# EAGLE design FluxR3-v1 (EAGLE 7.2.0)
ABBREV: Flux3; AUTHOR: Nadya B.; PROJECT: Fluxamasynth R3
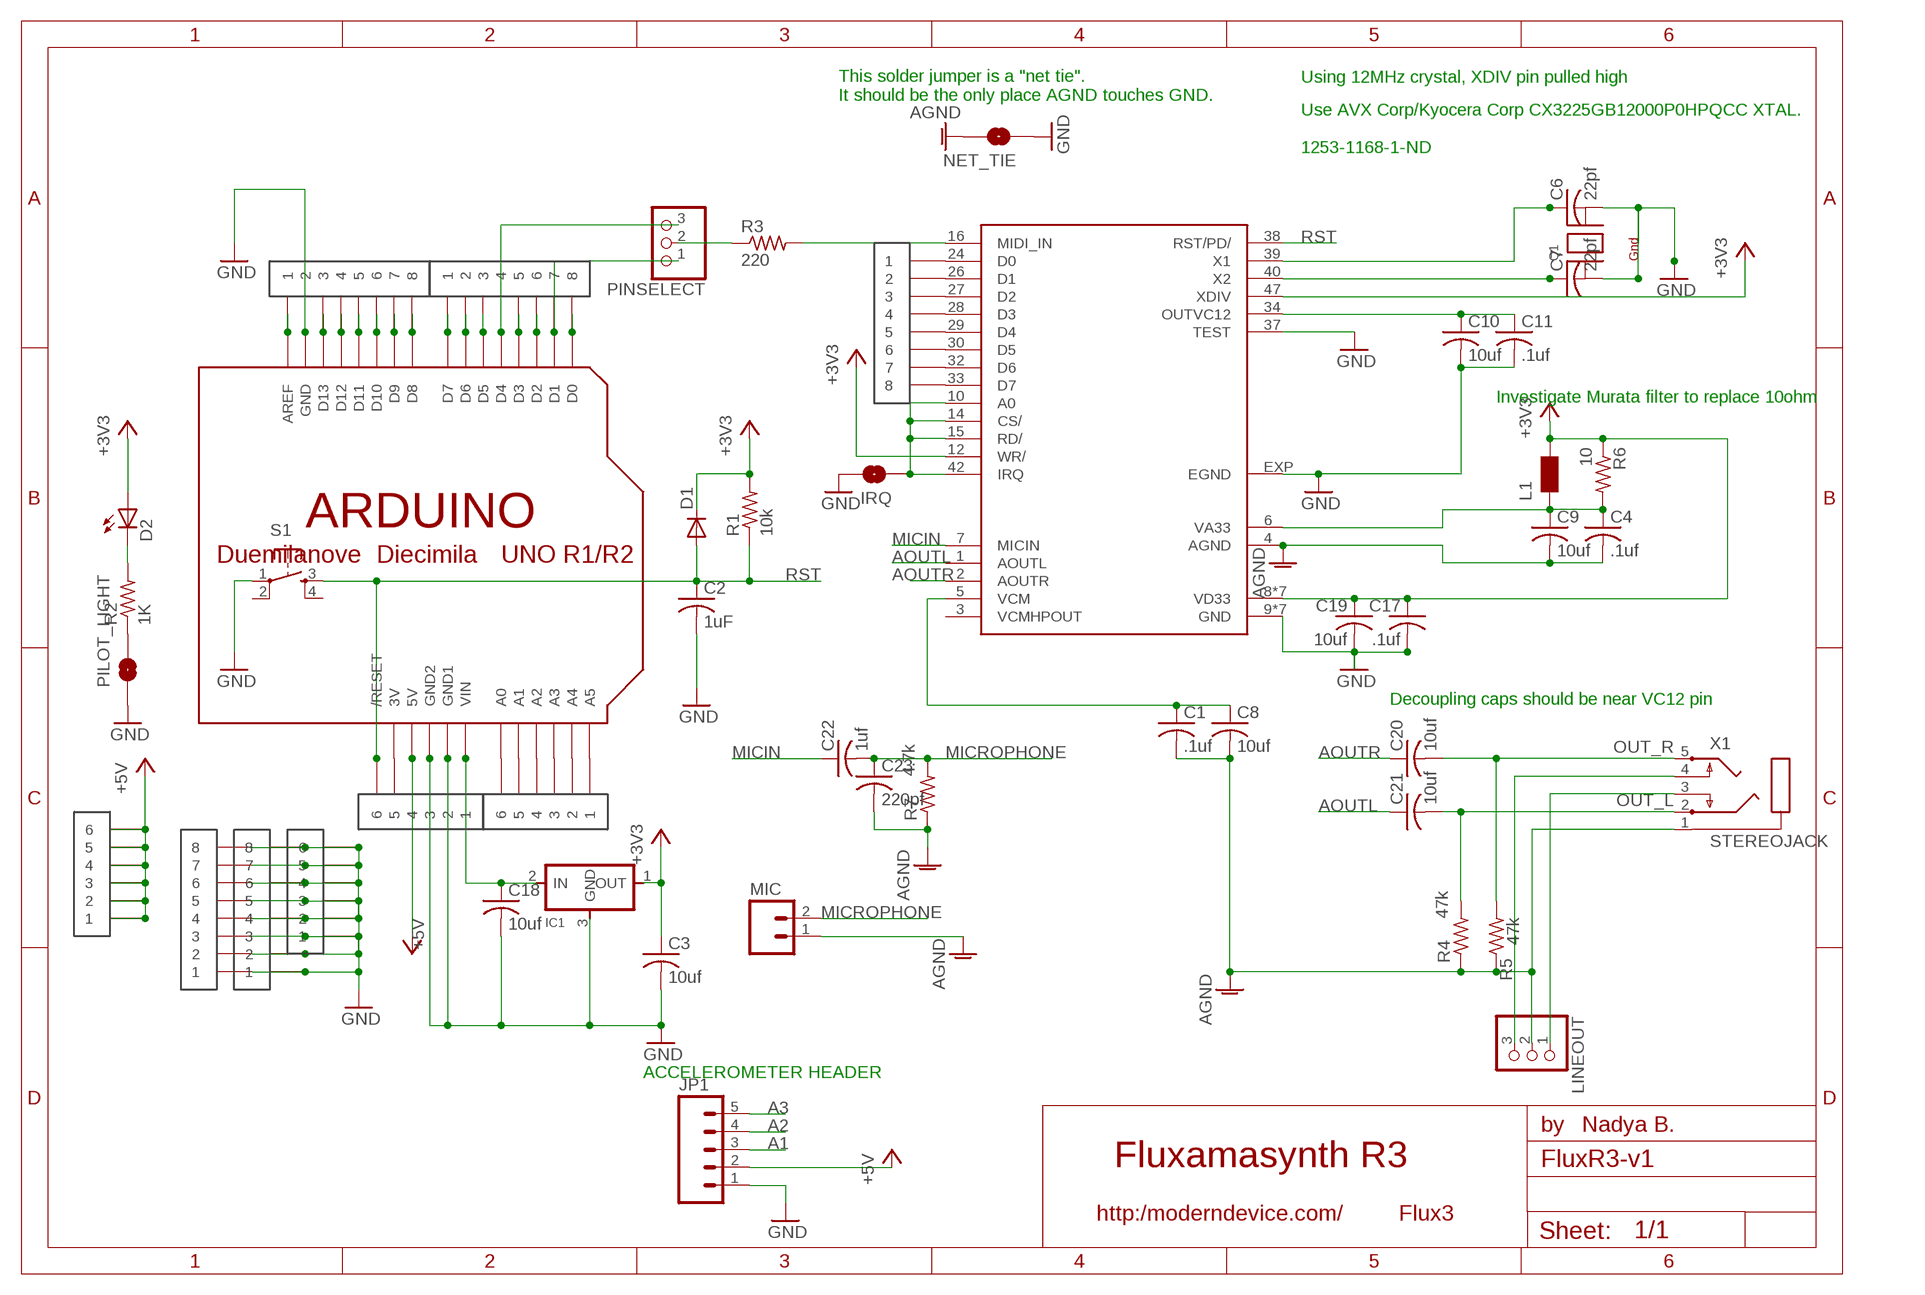
[diagram p0: schematic, sheet 1]

## Parts
C1  .1uf  C-USC0603K  [C0603K]
C2  1uF  C-USC0805  [C0805]
C3  10uf  C-USC0805  [C0805]
C4  .1uf  C-USC0603K  [C0603K]
C6  22pf  C-USC0805  [C0805]
C7  22pf  C-USC0805  [C0805]
C8  10uf  C-USC0805  [C0805]
C9  10uf  C-USC0805  [C0805]
C10  10uf  C-USC0805  [C0805]
C11  .1uf  C-USC0603K  [C0603K]
C17  .1uf  C-USC0603K  [C0603K]
C18  10uf  C-USC0805  [C0805]
C19  10uf  C-USC0805  [C0805]
C20  10uf  C-USC0805  [C0805]
C21  10uf  C-USC0805  [C0805]
C22  1uf  C-USC0805  [C0805]
C23  220pf  C-USC0805  [C0805]
D1  DIODESOD123  [SOD123]
D2  LED1206  [LED-1206]
IC1  REGULATORSOT23  [SOT23]
IRQ  MODERNDEVICE_SOLDERJUMPERTRACE  [MODERNDEVICE_SJ_2S-TRACE]
JP1  M05NOSILK  [1X05_NOSILK]
L1  FERRITE_BEAD_L0603  [R0603]
LINEOUT  PINHD-1X3  [1X03]
MIC  M02PTH  [1X02]
MIDI  1X8_CLEAN  [1X8_CLEAN]
NET_TIE  MODERNDEVICE_SOLDERJUMPERTRACE  [MODERNDEVICE_SJ_2S-TRACE]
PILOT_LIGHT  MODERNDEVICE_SOLDERJUMPERTRACE  [MODERNDEVICE_SJ_2S-TRACE]
PINSELECT  PINHD-1X3  [1X03]
Q1  MODERNDEVICE_XTAL-4-3225  [MODERNDEVICE_NX3225]
R1  10k  R-US_M0805  [M0805]
R2  1K  R-US_M0805  [M0805]
R3  220  R-US_M0805  [M0805]
R4  47k  R-US_R0603  [R0603]
R5  47k  R-US_R0603  [R0603]
R6  10  R-US_M0805  [M0805]
R7  4.7k  R-US_M0805  [M0805]
S1  6MM_SWITCH6MM_SWITCH  [6MM_SWITCH]
U1  SAM2695  [QFN48]
U$1  1X8_CLEAN  [1X8_CLEAN]
U$2  1X6_CLEAN  [1X6_CLEAN]
U$3  1X6_CLEAN  [1X6_CLEAN]
U$6  1X6_CLEAN  [1X6_CLEAN]
U$8  1X6_CLEAN  [1X6_CLEAN]
U$9  1X8_CLEAN  [1X8_CLEAN]
U$11  1X8_CLEAN  [1X8_CLEAN]
U$12  ARDUINO-NOHOLE  [ARDUINO-NOHOLE]
U$13  1X8_CLEAN  [1X8_CLEAN]
X1  STEREOJACK  [STX3100]

## Nets
+3V3 [VCC]: C3.1 C17.1 C19.1 D1.CATHODE(C) D2.A IC1.1(OUT) L1.2 R1.2 R6.1 U1.8(VD33) U1.11(VD33) U1.12(WR/) U1.20(VD33) U1.31(VD33) U1.35(VD33) U1.41(VD33) U1.46(VD33) U1.47(XDIV)
+5V [VCC]: JP1.2 U$2.P$1 U$2.P$2 U$2.P$3 U$2.P$4 U$2.P$5 U$2.P$6 U$6.P$4 U$12.5V
A0: U$8.P$6 U$12.A0
A1: JP1.3 U$8.P$5 U$12.A1
A2: JP1.4 U$8.P$4 U$12.A2
A3: JP1.5 U$8.P$3 U$12.A3
A4: U$8.P$2 U$12.A4
A5: U$8.P$1 U$12.A5
AGND [GND]: C1.2 C4.2 C8.2 C9.2 C23.2 LINEOUT.2 MIC.1 NET_TIE.2 R4.1 R5.1 R7.1 U1.4(AGND) X1.1
AOUTL: C21.1 U1.1(AOUTL)
AOUTR: C20.1 U1.2(AOUTR)
GND [GND]: C2.2 C3.2 C6.2 C7.2 C10.2 C11.2 C17.2 C18.2 C19.2 IC1.3(GND) IRQ.2 JP1.1 NET_TIE.1 PILOT_LIGHT.1 Q1.2(G2) Q1.4(G1) S1.1(P) U1.9(GND) U1.13(GND) U1.18(GND) U1.25(GND) U1.36(GND) U1.37(TEST) U1.45(GND) U1.48(GND) U1.EXP(EGND) U$1.P$1 U$1.P$2 U$1.P$3 U$1.P$4 U$1.P$5 U$1.P$6 U$1.P$7 U$1.P$8 U$3.P$1 U$3.P$2 U$3.P$3 U$3.P$4 U$3.P$5 U$3.P$6 U$6.P$2 U$6.P$3 U$11.P$1 U$11.P$2 U$11.P$3 U$11.P$4 U$11.P$5 U$11.P$6 U$11.P$7 U$11.P$8 U$12.GND U$12.GND1 U$12.GND2 U$13.P$2
MICIN: C22.1 U1.7(MICIN)
MICROPHONE: C22.2 C23.1 MIC.2 R7.2
N$1: PINSELECT.2 R3.1
N$2: R3.2 U1.16(MIDI_IN)
N$3 [GND]: IRQ.1 U1.10(A0) U1.14(CS/) U1.15(RD/) U1.42(IRQ)
N$4: U$6.P$5 U$12.3V
N$5: MIDI.P$1 U1.24(D0)
N$6: MIDI.P$2 U1.26(D1)
N$7: MIDI.P$3 U1.27(D2)
N$8: MIDI.P$4 U1.28(D3)
N$9: D2.C R2.2
N$10: MIDI.P$5 U1.29(D4)
N$11: MIDI.P$6 U1.30(D5)
N$12: C1.1 C8.1 U1.5(VCM)
N$13: MIDI.P$7 U1.32(D6)
N$14: MIDI.P$8 U1.33(D7)
N$15: U$12.D8 U$13.P$8
N$17: PINSELECT.1 U$9.P$7 U$12.D1
N$18: PINSELECT.3 U$9.P$4 U$12.D4
N$19: U$12.D9 U$13.P$7
N$21: LINEOUT.3 X1.4
N$22: U$12.D11 U$13.P$5
N$23: U$12.D10 U$13.P$6
N$24: LINEOUT.1 X1.3
N$25: U$12.D12 U$13.P$4
N$26: U$12.D13 U$13.P$3
N$27: U$9.P$2 U$12.D6
N$28: U$12.AREF U$13.P$1
N$29: U$9.P$3 U$12.D5
N$30: U$9.P$8 U$12.D0
N$31: U$9.P$6 U$12.D2
N$32: U$9.P$5 U$12.D3
N$35: U$9.P$1 U$12.D7
N$39 [VCC]: C4.1 C9.1 L1.1 R6.2 U1.6(VA33)
N$47: PILOT_LIGHT.2 R2.1
N$48: C6.1 U1.39(X1)
N$49: C7.1 U1.40(X2)
OUT_L: C21.2 R4.2 X1.2
OUT_R: C20.2 R5.2 X1.5
OUTVC12: C10.1 C11.1 U1.34(OUTVC12)
RST: C2.1 D1.ANODE(A) R1.1 S1.3(S) U1.38(RST/PD/) U$6.P$6 U$12.RESET(/RESET)
VIN [VCC]: C18.1 IC1.2(IN) U$6.P$1 U$12.VIN
Unconnected: Q1.1(X1) Q1.3(X2) S1.2(P1) S1.4(S1) U1.3(VCMHPOUT)

## Notes on the sheet
- Using 12MHz crystal, XDIV pin pulled high
- This solder jumper is a "net tie".
  It should be the only place AGND touches GND.
- Use AVX Corp/Kyocera Corp CX3225GB12000P0HPQCC XTAL. 
  
  1253-1168-1-ND
- Investigate Murata filter to replace 10ohm
- Decoupling caps should be near VC12 pin
- ACCELEROMETER HEADER

## Library data of the parts
C1-C4 C6-C11 C17-C23 = rcl:C-US: CAPACITOR, American symbol
D1 = ng:DIODE: DIODE high speed (Philips)
D2 = ModernDevice:LED: LEDs Standard schematic elements and footprints for 5mm, 3mm, 1206, and 0603 sized LEDs. 5mm - Spark Fun Electronics SKU : COM-00529 (and others)
IC1 = ng:REGULATOR
IRQ NET_TIE PILOT_LIGHT = BBLeo_v2:MODERNDEVICE_SOLDERJUMPER: Solder Jumper Standard SMD solder jumper. Used to automate production. Two varients : Normally Open and Normally Closed are the same, but have different paste layers. NC will have a large amount of paste and should jumper during reflow.
JP1 = ModernDevice:M05: Header 5 Standard 5-pin 0.1" header. Use with straight break away headers (SKU : PRT-00116), right angle break away headers (PRT-00553), swiss pins (PRT-00743), machine pins (PRT-00117), and female headers (PRT-00115). Molex polarized connector foot print use with SKU : PRT-08230 with associated crimp pins and housings.
L1 = ModernDevice:FERRITE_BEAD: SMD EMI Suppression Ferrite Beads - excellent anti-EMI properties - low DCR - impedances till 3000 ohms - rated current up to 6 A These pads are small for some reason - L0603 has std resistor sized pads 240-2365-1-ND is a Digikey part with 300 ohms at 100Mhz
LINEOUT PINSELECT = pinhead:PINHD-1X3: PIN HEADER
MIC = ModernDevice:M02: Header 2 Standard 2-pin 0.1" header. Use with straight break away headers (SKU : PRT-00116), right angle break away headers (PRT-00553), swiss pins (PRT-00743), machine pins (PRT-00117), and female headers (PRT-00115). Molex polarized connector foot print use with SKU : PRT-08233 with associated crimp pins and housings.
MIDI U$1 U$9 U$11 U$13 = ModernDevice:1X8_CLEAN
Q1 = BBLeo_v2:MODERNDEVICE_XTAL-4: Classic 4-pin 3.2 x 2.5mm crystal
R1-R7 = rcl:R-US_: RESISTOR, American symbol
S1 = ng:6MM_SWITCH: OMRON SWITCH
U1 = ModernDevice:SAM2695
U$2 U$3 U$6 U$8 = ModernDevice:1X6_CLEAN
U$12 = adafruit:ARDUINO: Arduino Diecimila/Duemilanove Make a shield with ease, this package has all the named pins as well as the two mounting drill holes and an outline of the USB and DC power connector. The outline is on the DIMENSION layer, so if your board house uses it they will cut the outline to match. http://www.ladyada.net/library/pcb/eaglelibrary.html
X1 = adafruit:STEREOJACK: MIC/HEADPHONE JACK Stereo jack with two switches. Kycon STX3100, CUI SJ1-3555NG and/or 4UCon 05544

## Net classes
1 GND: width 0.305 mm
2 VCC: width 0.305 mm
3 VBUS: width 0.508 mm

## Board
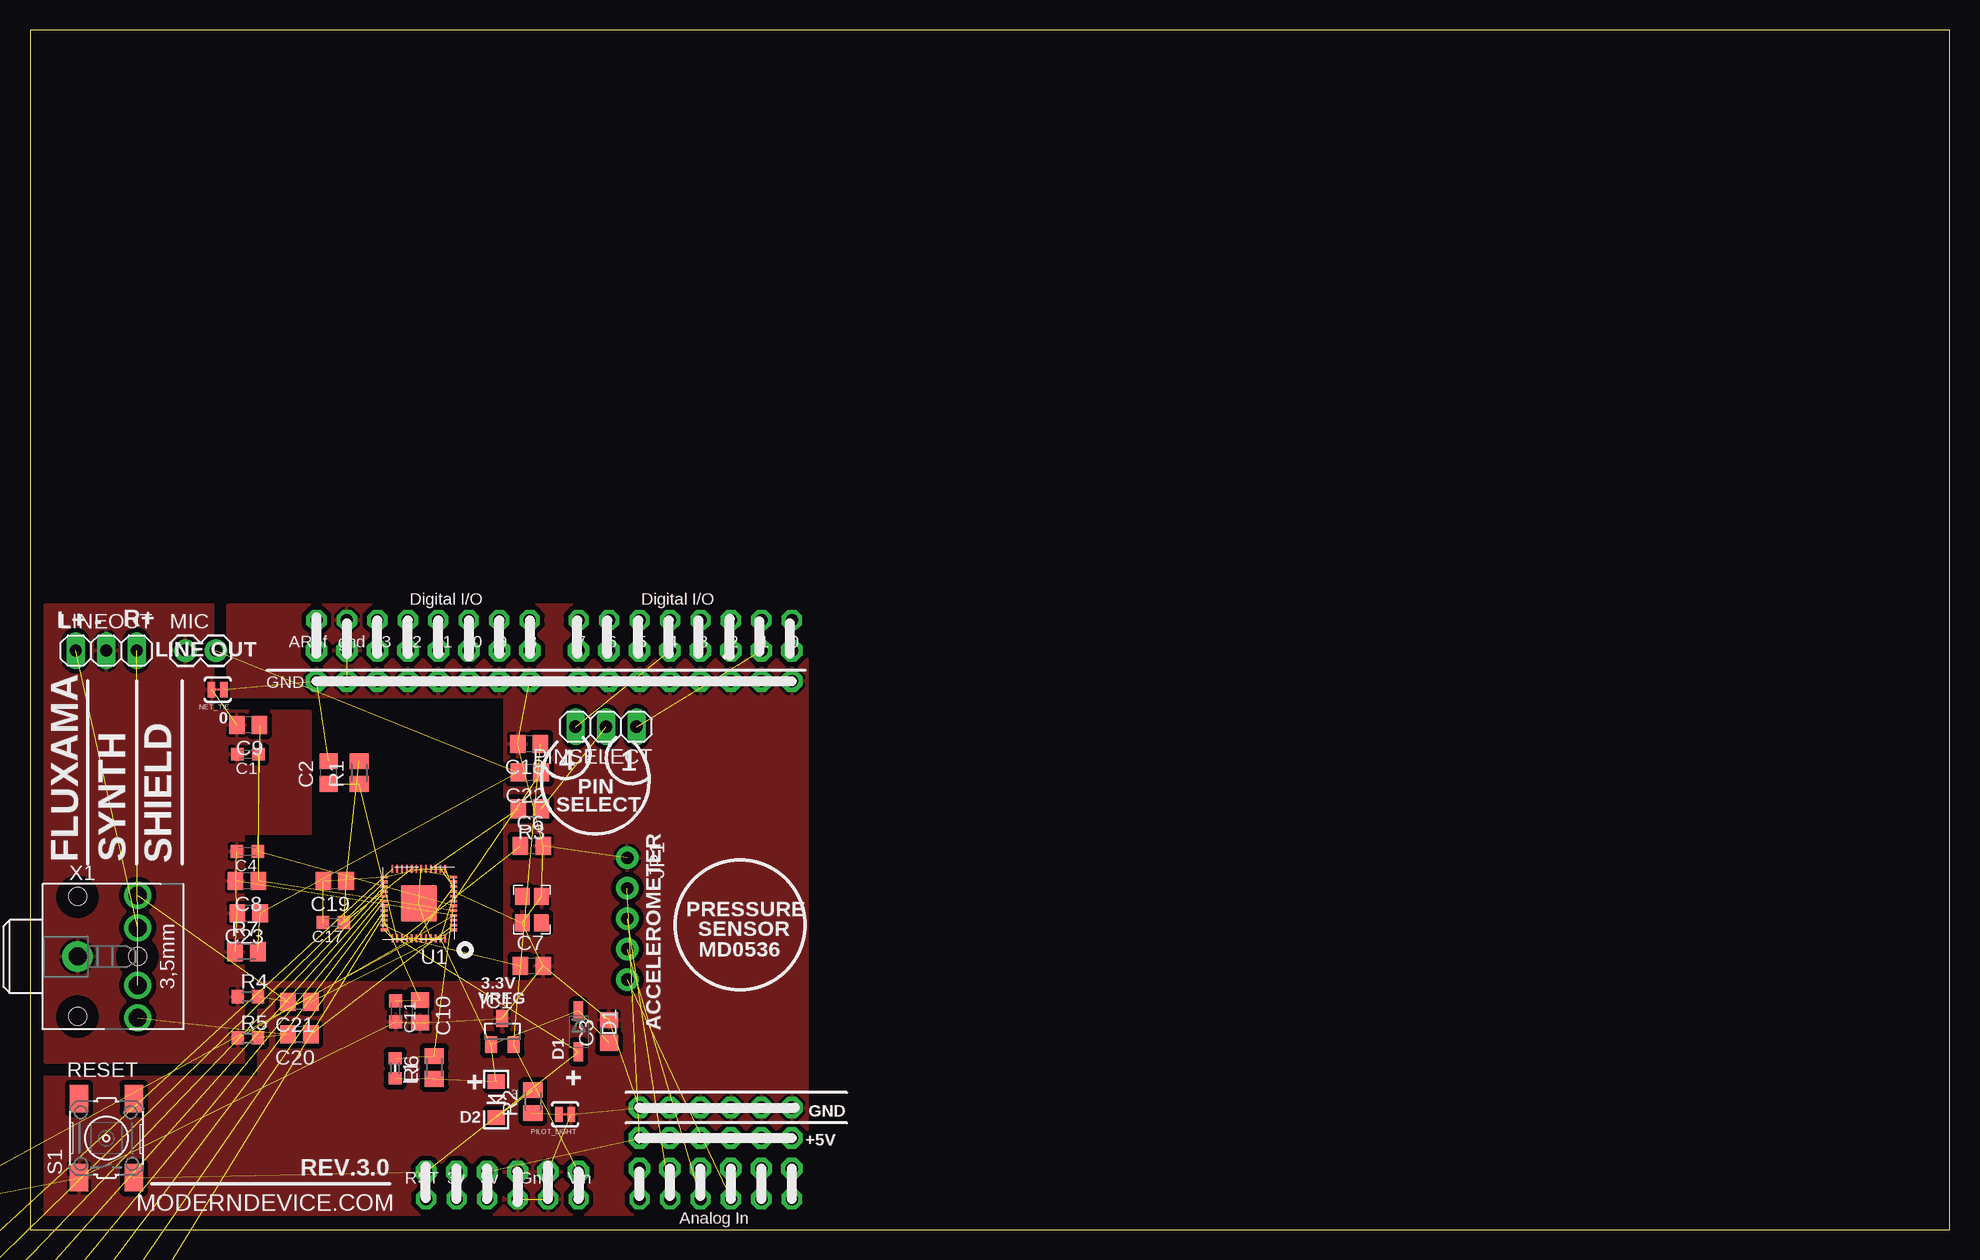
[diagram p1: board, top side]
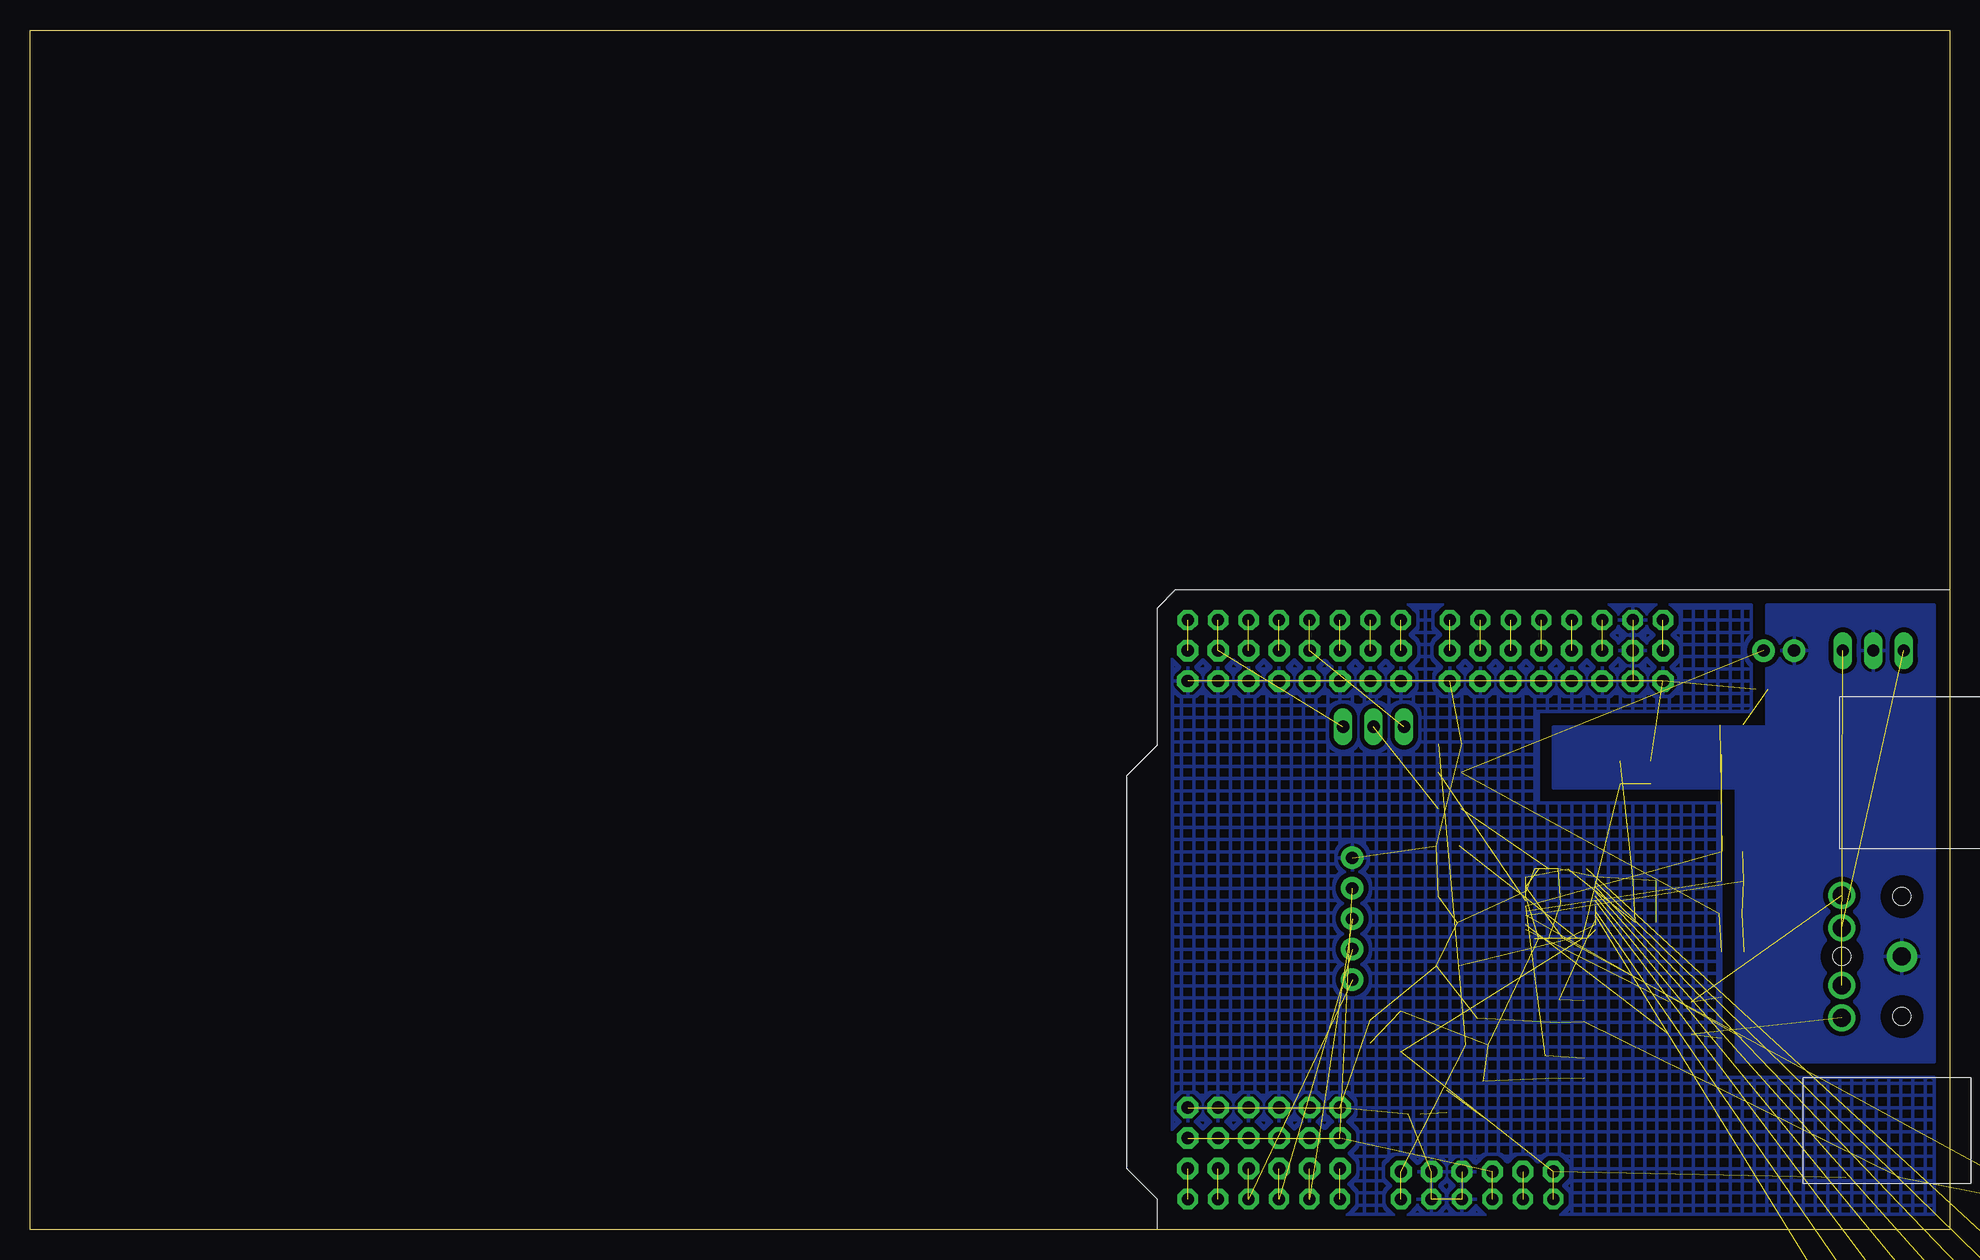
[diagram p2: board, bottom side, seen from below]

Size 160 x 100 mm. Coordinates in mm from the lower left corner, seen from the top.
Outline: 0,0 160,0 160,100 0,100 0,0
Copper layers (1*16): Top 0.035mm / dielectric 1.5mm / Bottom 0.035mm
Design rules "default": minimum track width 10mil, minimum drill 24mil, track to track 8mil, track to pad 8mil, pad to pad 8mil, via to via 8mil, smd to smd 8mil, copper to edge 40mil, drill to drill 8mil, minimum pad ring 10mil, minimum via ring 8mil, stop-mask expansion 4mil, vias tented up to drill 0mil, thermal gap 10mil

### Footprints (pad centres in the part's own frame; a part is rotated, then mirrored left to right if it is on the bottom)
C0603K = smd 1.05 x 1.08: 1 -0.875,0; 2 0.875,0
C0805 = smd 1.3 x 1.5: 1 -0.95,0; 2 0.95,0
SOD123 = smd 1.6 x 0.8: ANODE 1.7,0; CATHODE -1.7,0
LED-1206 = smd 1.2 x 1.4: A -1.5,0; C 1.5,0
SOT23 = smd 1 x 1.4: 1 -0.95,-1.1; 2 0.95,-1.1; 3 0,1.1
MODERNDEVICE_SJ_2S-TRACE = smd 0.635 x 1.27: 1 -0.508,0; 2 0.508,0
1X05_NOSILK = drill 1.016 pad 1.88: 1 0,0; 2 2.54,0; 3 5.08,0; 4 7.62,0; 5 10.16,0
R0603 = smd 1 x 1.1: 1 -0.85,0; 2 0.85,0
1X03 = drill 1.016 long: 1 -2.54,0; 2 0,0; 3 2.54,0
1X02 = drill 1.016 pad 1.88: 1 0,0; 2 2.54,0
1X8_CLEAN = drill 1.016 pad 1.778 octagon: P$1 -8.89,0; P$2 -6.35,0; P$3 -3.81,0; P$4 -1.27,0; P$5 1.27,0; P$6 3.81,0; P$7 6.35,0; P$8 8.89,0
MODERNDEVICE_NX3225 = smd 1.4 x 1.2: 1 -1.1,-0.8; 2 1.1,-0.8; 3 1.1,0.8; 4 -1.1,0.8
M0805 = smd 1.3 x 1.6: 1 -0.95,0; 2 0.95,0
6MM_SWITCH = smd 2.286 x 1.524: 1 -3.302,2.286; 2 3.302,2.286; 3 -3.302,-2.286; 4 3.302,-2.286
QFN48 = smd 0.65 x 0.2: 1 -2.9,2.3; 2 -2.9,1.9; 3 -2.9,1.5; 4 -2.9,1.1; 5 -2.9,0.7; 6 -2.9,0.3; 7 -2.9,-0.1; 8 -2.9,-0.5; 9 -2.9,-0.9; 10 -2.9,-1.3; 11 -2.9,-1.7; 12 -2.9,-2.1; 25 2.9,-2.1; 26 2.9,-1.7; 27 2.9,-1.3; 28 2.9,-0.9; 29 2.9,-0.5; 30 2.9,-0.1; 31 2.9,0.3; 32 2.9,0.7; 33 2.9,1.1; 34 2.9,1.5; 35 2.9,1.9; 36 2.9,2.3 | smd 0.2 x 0.65: 13 -2.2,-2.8; 14 -1.8,-2.8; 15 -1.4,-2.8; 16 -1,-2.8; 17 -0.6,-2.8; 18 -0.2,-2.8; 19 0.2,-2.8; 20 0.6,-2.8; 21 1,-2.8; 22 1.4,-2.8; 23 1.8,-2.8; 24 2.2,-2.8; 37 2.2,3; 38 1.8,3; 39 1.4,3; 40 1,3; 41 0.6,3; 42 0.2,3; 43 -0.2,3; 44 -0.6,3; 45 -1,3; 46 -1.4,3; 47 -1.8,3; 48 -2.2,3 | smd 3 x 3: EXP 0,0.1
1X6_CLEAN = drill 1.016 pad 1.778 octagon: P$1 -6.35,0; P$2 -3.81,0; P$3 -1.27,0; P$4 1.27,0; P$5 3.81,0; P$6 6.35,0
ARDUINO-NOHOLE = drill 1 pad 1.676 octagon: 3V 35.56,2.54; 5V 38.1,2.54; A0 50.8,2.54; A1 53.34,2.54; A2 55.88,2.54; A3 58.42,2.54; A4 60.96,2.54; A5 63.5,2.54; AREF 23.876,50.8; D0 63.5,50.8; D1 60.96,50.8; D2 58.42,50.8; D3 55.88,50.8; D4 53.34,50.8; D5 50.8,50.8; D6 48.26,50.8; D7 45.72,50.8; D8 41.656,50.8; D9 39.116,50.8; D10 36.576,50.8; D11 34.036,50.8; D12 31.496,50.8; D13 28.956,50.8; GND 26.416,50.8; GND1 43.18,2.54; GND2 40.64,2.54; RESET 33.02,2.54; VIN 45.72,2.54
STX3100 = drill 1.5 pad 2.54: 1 2.7,-0.1 | drill 1.5: 2 7.7,5; 3 7.7,2.3; 4 7.7,-2.5; 5 7.7,-5.2 | hole 1.5: 2.7,4.9; 2.7,-5.1; 7.7,-0.1

### Placement (x,y rotation side)
C1  18.16,39.62 180 top
C2  24.89,38.1 90 top
C3  48.26,16.51 90 top
C4  18.11,31.52 180 top
C6  41.83,32 0 top
C7  41.83,22 0 top
C8  18.08,29.06 180 top
C9  18.19,42.06 180 top
C10  32.51,18.19 270 top
C11  30.48,18.19 270 top
C17  25.3,25.6 180 top
C18  41.61,40.49 180 top
C19  25.4,29.06 180 top
C20  22.45,16.26 180 top
C21  22.45,19 180 top
C22  41.66,38.1 180 top
C23  18.24,26.37 180 top
D1  45.72,16.51 270 top
D2  38.86,10.85 270 top
IC1  39.37,16.51 0 top
IRQ  -8.13,2.03 0 top  (outside the outline)
JP1  49.78,30.99 270 top
L1  30.43,13.44 270 top
LINEOUT  6.35,48.26 0 top
MIC  12.95,48.26 0 top
MIDI  2.03,-4.06 0 top  (outside the outline)
NET_TIE  15.65,45.01 180 top
PILOT_LIGHT  44.6,9.6 180 top
PINSELECT  48.01,41.91 180 top
Q1  41.83,26.67 90 top
R1  27.43,38.1 90 top
R2  41.91,10.67 90 top
R3  41.66,35.05 180 top
R4  18.16,19.41 0 top
R5  18.16,15.98 0 top
R6  33.68,13.51 90 top
R7  18.03,23.16 0 top
S1  6.37,7.62 90 top
U1  32.41,27.28 180 top
U$1  54.61,45.72 0 top
U$2  57.15,7.62 0 top
U$3  57.15,10.16 0 top
U$6  39.37,4.83 180 top
U$8  57.15,5.08 180 top
U$9  54.61,48.26 0 top
U$11  32.77,45.72 0 top
U$12  0,0 0 top
U$13  32.77,48.26 0 top
X1  1.27,22.86 0 top

### Tracks (layer width: path | path; a pad name or v marks a point on that pad's centre or on a via)
+3V3  (17 unrouted)
+5V  (8 unrouted)
A0  (1 unrouted)
A1  (2 unrouted)
A2  (2 unrouted)
A3  (2 unrouted)
A4  (1 unrouted)
A5  (1 unrouted)
AGND  (6 unrouted)
  pour Bottom (isolate 0.406): 1.27,52.07 15.24,52.07 15.24,41.91 33.02,41.91 33.02,36.83 17.78,36.83 17.78,13.97 1.27,13.97
  pour Top (isolate 0.406): 1.27,52.07 15.24,52.07 15.24,43.18 23.37,43.18 23.37,33.02 17.78,33.02 17.78,13.97 1.27,13.97
AOUTL  (1 unrouted)
AOUTR  (1 unrouted)
GND  (53 unrouted)
  pour Bottom (isolate 0.406, hatched): 16.51,52.07 16.51,43.18 34.29,43.18 34.29,35.56 19.05,35.56 19.05,12.7 1.27,12.7 1.27,1.27 64.77,1.27 64.77,52.07
  pour Top (isolate 0.406): 16.51,52.07 16.51,44.45 39.62,44.45 39.62,20.57 19.05,20.57 19.05,12.7 1.27,12.7 1.27,1.27 64.77,1.27 64.77,52.07
MICIN  (1 unrouted)
MICROPHONE  (3 unrouted)
N$1  (1 unrouted)
N$2  (1 unrouted)
N$3  (4 unrouted)
N$4  (1 unrouted)
N$5  (1 unrouted)
N$6  (1 unrouted)
N$7  (1 unrouted)
N$8  (1 unrouted)
N$9  (1 unrouted)
N$10  (1 unrouted)
N$11  (1 unrouted)
N$12  (2 unrouted)
N$13  (1 unrouted)
N$14  (1 unrouted)
N$15  (1 unrouted)
N$17  (2 unrouted)
N$18  (2 unrouted)
N$19  (1 unrouted)
N$21  (1 unrouted)
N$22  (1 unrouted)
N$23  (1 unrouted)
N$24  (1 unrouted)
N$25  (1 unrouted)
N$26  (1 unrouted)
N$27  (1 unrouted)
N$28  (1 unrouted)
N$29  (1 unrouted)
N$30  (1 unrouted)
N$31  (1 unrouted)
N$32  (1 unrouted)
N$35  (1 unrouted)
N$39  (4 unrouted)
N$47  (1 unrouted)
N$48  (1 unrouted)
N$49  (1 unrouted)
OUT_L  (2 unrouted)
OUT_R  (2 unrouted)
OUTVC12  (2 unrouted)
RST  (6 unrouted)
VIN  (3 unrouted)

### Text on the board
tPlace: L+ | - | R+ | LINE OUT | GND | 0 | 4 | 1 | PIN | SELECT | FLUXAMA | SYNTH | SHIELD | PRESSURE | SENSOR | MD0536 | 3.3V | VREG | D1 | RESET | + | + | D2 | GND | +5V | REV.3.0 | MODERNDEVICE.COM
_tsilk: ACCELEROMETER